# Altium project MailboxSensorV2.PrjPcb (part 2 of 4)
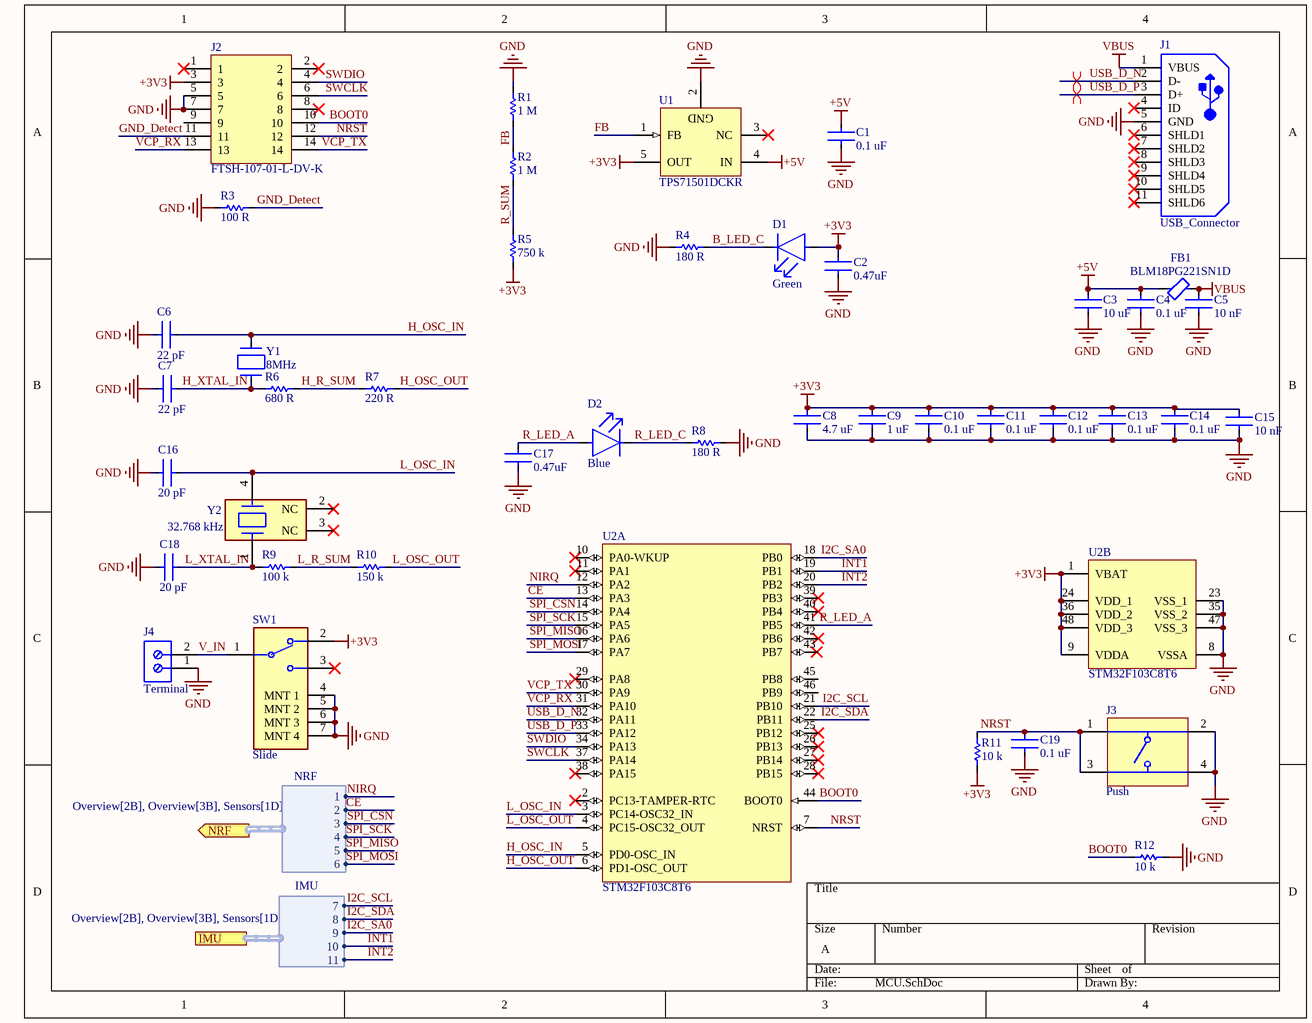
[diagram p3: MCU.SchDoc]

## Sheet MCU.SchDoc (continued)
### Library data of the parts
C1 C4 C10-C14 C19 = 0_1uF_0603_Capacitor: Ceramic Capacitor, Multilayer, Ceramic, 50V, 10% +Tol, 10% -Tol, X8L, -40/+15% TC, 0.1uF, Surface Mount, 0603, GCM188L81H104KA57D; Manufacturer: Murata; Value: 100nF; Multilayer: Yes; Reference Standard: AEC-Q200; Supplier: Digikey; Supplier Part Number: 490-6049-1-ND; Manufacturer Part Number: GCM188L81H104KA57D; RoHS: Yes; Category: Ceramic Capacitors; Stock: 1946064; Pricing: 1=0.13, 10=0.087, 50=0.0522, 100=0.0411, 500=0.03032, 1000=0.0251 (USD); Mounting Technology: Surface Mount; Pins: 2; Dielectric Material: Ceramic; Package Shape: Rectangular; Case/Package: 0603; Terminal Finish: Nickel; Min Operating Temperature: -55°C; Max Operating Temperature: 150°C; JESD-609 Code: e3; Capacitor Type: Ceramic; Tolerance  (fill in as +-): 10%; Packaging: Tape and Reel; Tolerance (fill in as +-): 10%; Rated DC Voltage (URdc): 50V; Temperature Characteristics Code: X8L; Termination: Wraparound; Reach SVHC Compliant: Yes; RoHS Compliant: Yes; ComponentLink1URL: https://datasheet.ciiva.com:443/pdfs/VipMasterIC/IC/MURE/MURE-S-A0004370842/MURE-S-A0004371512-1.pdf?src-supplier=IHS+Markit; ComponentLink1Description: https://datasheet.ciiva.com:443/pdfs/VipMasterIC/IC/MURE/MURE-S-A0004370842/MURE-S-A0004371512-1.pdf?src-supplier=IHS+Markit; Supplier 1: Digikey; Supplier Part Number 1: 490-6049-1-ND
C2 C17 = 0_47uF_0603_Capacitor: Ceramic Capacitor, Multilayer, Ceramic, 25V, 10% +Tol, 10% -Tol, X7R, 15% TC, 0.47uF, Surface Mount, 0603, GRM188R71E474KA12D; Manufacturer: Murata; Value: 470nF; Multilayer: Yes; Supplier: Digikey; Supplier Part Number: 490-3291-1-ND; Manufacturer Part Number: GRM188R71E474KA12D; RoHS: Yes; Category: Ceramic Capacitors; Stock: 1965293; Pricing: 1=0.16, 10=0.107, 50=0.0642, 100=0.0505, 500=0.03728, 1000=0.03087 (USD); Mounting Technology: Surface Mount; Pins: 2; Dielectric Material: Ceramic; Package Shape: Rectangular; Case/Package: 0603; Terminal Finish: Nickel; Min Operating Temperature: -55°C; Max Operating Temperature: 125°C; Capacitor Type: Ceramic; Tolerance  (fill in as +-): 10%; Package Style: SMTMeter; Packaging: Tape and Reel; Tolerance (fill in as +-): 10%; Rated DC Voltage (URdc): 25V; Temperature Characteristics Code: X7R; Termination: Wraparound; JESD-609 Code: e3; Length: 1.6mm; Width: 0.8mm; Height: 0.8mm; Reach SVHC Compliant: Yes; RoHS Compliant: Yes; ComponentLink1URL: https://datasheet.ciiva.com:443/pdfs/VipMasterIC/IC/MURE/MURE-S-A0004380799/MURE-S-A0004387457-1.pdf?src-supplier=IHS+Markit; ComponentLink1Description: https://datasheet.ciiva.com:443/pdfs/VipMasterIC/IC/MURE/MURE-S-A0004380799/MURE-S-A0004387457-1.pdf?src-supplier=IHS+Markit; Supplier 1: Digikey; Supplier Part Number 1: 490-3291-1-ND
C3 = 10uF_0603_Capacitor: Ceramic Capacitor, Multilayer, Ceramic, 6.3V, 10% +Tol, 10% -Tol, X5R, 15% TC, 10uF, Surface Mount, 0603, GRM188R60J106KE47D; Manufacturer: Murata; Multilayer: Yes; Supplier: Digikey; Supplier Part Number: 490-12538-1-ND; Manufacturer Part Number: GRM188R60J106KE47D; RoHS: Yes; Category: Ceramic Capacitors; Stock: 318904; Pricing: 1=0.13, 10=0.089, 50=0.053, 100=0.0417, 500=0.03078, 1000=0.02549 (USD); Mounting Technology: Surface Mount; Pins: 2; Dielectric Material: Ceramic; Package Shape: Rectangular; Case/Package: 0603; Terminal Finish: Nickel; Min Operating Temperature: -55°C; Max Operating Temperature: 85°C; JESD-609 Code: e3; Value: 10uF; Capacitor Type: Ceramic; Tolerance  (fill in as +-): 10%; Packaging: Tape and Reel; Tolerance (fill in as +-): 10%; Rated DC Voltage (URdc): 6.3V; Temperature Characteristics Code: X5R; Termination: Wraparound; Reach SVHC Compliant: Yes; RoHS Compliant: Yes; ComponentLink1URL: https://psearch.en.murata.com:443/capacitor/product/GRM188R60J106KE47%23.pdf?src-supplier=IHS+Markit; ComponentLink1Description: https://psearch.en.murata.com:443/capacitor/product/GRM188R60J106KE47%23.pdf?src-supplier=IHS+Markit; ComponentLink2URL: http://www.farnell.com/datasheets/1955679.pdf?src-supplier=Farnell; ComponentLink2Description: http://www.farnell.com/datasheets/1955679.pdf?src-supplier=Farnell; ComponentLink3URL: http://www.mouser.com/ds/2/281/c02e-2905.pdf?src-supplier=Mouser; ComponentLink3Description: http://www.mouser.com/ds/2/281/c02e-2905.pdf?src-supplier=Mouser; ComponentLink4URL: http://search.murata.co.jp/Ceramy/image/img/A01X/G101/ENG/GRM188R60J106KE47-02.pdf?src-supplier=Digikey; ComponentLink4Description: http://search.murata.co.jp/Ceramy/image/img/A01X/G101/ENG/GRM188R60J106KE47-02.pdf?src-supplier=Digikey; ComponentLink5URL: http://psearch.en.murata.com/capacitor/product/GRM188R60J106KE47%23.pdf?src-supplier=Avnet; ComponentLink5Description: http://psearch.en.murata.com/capacitor/product/GRM188R60J106KE47%23.pdf?src-supplier=Avnet; ComponentLink6URL: https://datasheet.octopart.com/GRM188R60J106KE47D-Murata-datasheet-76796297.pdf?src-supplier=Future+Electronics; ComponentLink6Description: https://datasheet.octopart.com/GRM188R60J106KE47D-Murata-datasheet-76796297.pdf?src-supplier=Future+Electronics; ComponentLink7URL: https://datasheet.octopart.com/GRM188R60J106KE47D-Murata-datasheet-46741883.pdf?src-supplier=Element14; ComponentLink7Description: https://datasheet.octopart.com/GRM188R60J106KE47D-Murata-datasheet-46741883.pdf?src-supplier=Element14; ComponentLink8URL: http://www.farnell.com/datasheets/1955679.pdf?src-supplier=Newark; ComponentLink8Description: http://www.farnell.com/datasheets/1955679.pdf?src-supplier=Newark; ComponentLink9URL: http://www.farnell.com/datasheets/1955679.pdf?src-supplier=Element14; ComponentLink9Description: http://www.farnell.com/datasheets/1955679.pdf?src-supplier=Element14; Supplier 1: Digikey; Supplier Part Number 1: 490-12538-1-ND
C5 C15 = 10nF_0603_Capacitor: Ceramic Capacitor, Multilayer, Ceramic, 50V, 10% +Tol, 10% -Tol, X7R, 15% TC, 0.01uF, Surface Mount, 0603, CC0603KRX7R9BB103; Manufacturer: Yageo; Value: 10nF; Multilayer: Yes; Supplier: Digikey; Supplier Part Number: 311-1085-1-ND; Manufacturer Part Number: CC0603KRX7R9BB103; RoHS: Yes; Category: Ceramic Capacitors; Stock: 4399663; Pricing: 1=0.1, 10=0.031, 50=0.0176, 100=0.0136, 500=0.01026, 1000=0.00805 (USD); Mounting Technology: Surface Mount; Pins: 2; Dielectric Material: Ceramic; Package Shape: Rectangular; Case/Package: 0603; Terminal Finish: Nickel; Min Operating Temperature: -55°C; Max Operating Temperature: 125°C; JESD-609 Code: e3; Capacitor Type: Ceramic; Tolerance  (fill in as +-): 10%; Package Style: SMTMeter; Packaging: Tape and Reel; Tolerance (fill in as +-): 10%; Rated DC Voltage (URdc): 50V; Temperature Characteristics Code: X7R; Termination: Wraparound; Length: 1.6mm; Width: 0.8mm; Height: 0.8mm; Reach SVHC Compliant: Yes; RoHS Compliant: Yes; ComponentLink1URL: https://datasheet.ciiva.com:443/pdfs/VipMasterIC/IC/YAGO/YAGO-S-A0003557223/YAGO-S-A0003557223-1.pdf?src-supplier=IHS+Markit; ComponentLink1Description: https://datasheet.ciiva.com:443/pdfs/VipMasterIC/IC/YAGO/YAGO-S-A0003557223/YAGO-S-A0003557223-1.pdf?src-supplier=IHS+Markit; Supplier 1: Digikey; Supplier Part Number 1: 311-1085-1-ND
C6 C7 = 22pF_0603_Capacitor: Ceramic Capacitor, Multilayer, Ceramic, 100V, 5% +Tol, 5% -Tol, C0G, 30ppm/Cel TC, 0.000022uF, Surface Mount, 0603, GCM1885C2A220JA16D; Manufacturer: Murata; Value: 22pF; Multilayer: Yes; Reference Standard: AEC-Q200; Supplier: Digikey; Supplier Part Number: 490-4942-1-ND; Manufacturer Part Number: GCM1885C2A220JA16D; RoHS: Yes; Category: Ceramic Capacitors; Stock: 113473; Pricing: 1=0.11, 10=0.074, 50=0.0424, 100=0.0329, 500=0.02476, 1000=0.01946 (USD); Mounting Technology: Surface Mount; Pins: 2; Dielectric Material: Ceramic; Package Shape: Rectangular; Case/Package: 0603; Terminal Finish: Nickel; Min Operating Temperature: -55°C; Max Operating Temperature: 125°C; JESD-609 Code: e3; Capacitor Type: Ceramic; Tolerance  (fill in as +-): 5%; Package Style: SMTMeter; Packaging: Tape and Reel; Tolerance (fill in as +-): 5%; Rated DC Voltage (URdc): 100V; Temperature Characteristics Code: C0G; Termination: Wraparound; Length: 1.6mm; Width: 0.8mm; Height: 0.9mm; Reach SVHC Compliant: Yes; RoHS Compliant: Yes; ComponentLink1URL: https://datasheet.ciiva.com:443/pdfs/VipMasterIC/IC/MURE/MURE-S-A0004365318/MURE-S-A0004370424-1.pdf?src-supplier=IHS+Markit; ComponentLink1Description: https://datasheet.ciiva.com:443/pdfs/VipMasterIC/IC/MURE/MURE-S-A0004365318/MURE-S-A0004370424-1.pdf?src-supplier=IHS+Markit; ComponentLink2URL: https://datasheet.ciiva.com/133/product-133318.pdf?src-supplier=Digikey; ComponentLink2Description: https://datasheet.ciiva.com/133/product-133318.pdf?src-supplier=Digikey; ComponentLink3URL: https://datasheet.ciiva.com/133/product-133319.pdf?src-supplier=Digikey; ComponentLink3Description: https://datasheet.ciiva.com/133/product-133319.pdf?src-supplier=Digikey; ComponentLink4URL: https://datasheet.ciiva.com/133/product-133320.pdf?src-supplier=Digikey; ComponentLink4Description: https://datasheet.ciiva.com/133/product-133320.pdf?src-supplier=Digikey; Supplier 1: Digikey; Supplier Part Number 1: 490-4942-1-ND
C8 = 4_7uF_0603_Capacitor: Ceramic Capacitor, Multilayer, Ceramic, 16V, 10% +Tol, 10% -Tol, X5R, 15% TC, 4.7uF, Surface Mount, 0603, GRM188R61C475KAAJD; Manufacturer: Murata; Multilayer: Yes; Supplier: Mouser; Supplier Part Number: 81-GRM188R61C475KAJD; Manufacturer Part Number: GRM188R61C475KAAJD; RoHS: Yes; Category: Ceramic Capacitors; Stock: 109257; Pricing: 1=0.28, 10=0.194, 50=0.194, 100=0.117, 1000=0.09, 10000=0.074 (USD); Mounting Technology: Surface Mount; Pins: 2; Dielectric Material: Ceramic; Package Shape: Rectangular; Case/Package: 0603; Terminal Finish: Nickel; Min Operating Temperature: -55°C; Max Operating Temperature: 85°C; JESD-609 Code: e3; Value: 4.7uF; Capacitor Type: Ceramic; Tolerance  (fill in as +-): 10%; Packaging: Tape and Reel; Tolerance (fill in as +-): 10%; Rated DC Voltage (URdc): 16V; Temperature Characteristics Code: X5R; Termination: Wraparound; Reach SVHC Compliant: Yes; RoHS Compliant: Yes; ComponentLink1URL: https://datasheet.ciiva.com:443/pdfs/VipMasterIC/IC/MURE/MURE-S-A0004349797/MURE-S-A0004352628-1.pdf?src-supplier=IHS+Markit; ComponentLink1Description: https://datasheet.ciiva.com:443/pdfs/VipMasterIC/IC/MURE/MURE-S-A0004349797/MURE-S-A0004352628-1.pdf?src-supplier=IHS+Markit; ComponentLink2URL: https://datasheet.ciiva.com/14813/595grm188r61c475kaaj23-14813668.pdf?src-supplier=Arrow+Electronics; ComponentLink2Description: https://datasheet.ciiva.com/14813/595grm188r61c475kaaj23-14813668.pdf?src-supplier=Arrow+Electronics; Supplier 1: Mouser; Supplier Part Number 1: 81-GRM188R61C475KAJD
C9 = 1uF_0603_Capacitor: Ceramic Capacitor, Multilayer, Ceramic, 50V, 10% +Tol, 10% -Tol, X5R, 15% TC, 1uF, Surface Mount, 0603, CC0603KRX5R9BB105; Manufacturer: Yageo; Multilayer: Yes; Supplier: Digikey; Supplier Part Number: 311-1787-1-ND; Manufacturer Part Number: CC0603KRX5R9BB105; RoHS: Yes; Category: Ceramic Capacitors; Stock: 90188; Pricing: 1=0.27, 10=0.178, 50=0.1124, 100=0.09, 500=0.065, 1000=0.05749 (USD); Mounting Technology: Surface Mount; Pins: 2; Dielectric Material: Ceramic; Package Shape: Rectangular; Case/Package: 0603; Terminal Finish: Nickel; Min Operating Temperature: -55°C; Max Operating Temperature: 85°C; JESD-609 Code: e3; Value: 1uF; Capacitor Type: Ceramic; Tolerance  (fill in as +-): 10%; Package Style: SMTMeter; Packaging: Tape and Reel; Tolerance (fill in as +-): 10%; Rated DC Voltage (URdc): 50V; Temperature Characteristics Code: X5R; Termination: Wraparound; Length: 1.6mm; Width: 0.8mm; Height: 0.8mm; Reach SVHC Compliant: Yes; RoHS Compliant: Yes; ComponentLink1URL: https://datasheet.ciiva.com:443/pdfs/VipMasterIC/IC/YAGO/YAGO-S-A0006851646/YAGO-S-A0006851646-1.pdf?src-supplier=IHS+Markit; ComponentLink1Description: https://datasheet.ciiva.com:443/pdfs/VipMasterIC/IC/YAGO/YAGO-S-A0006851646/YAGO-S-A0006851646-1.pdf?src-supplier=IHS+Markit; ComponentLink2URL: http://www.mouser.com/ds/2/447/Yageo_UPY-GP_NP0_16V-to-50V_9-358835.pdf?src-supplier=Mouser; ComponentLink2Description: http://www.mouser.com/ds/2/447/Yageo_UPY-GP_NP0_16V-to-50V_9-358835.pdf?src-supplier=Mouser; ComponentLink3URL: https://datasheet.octopart.com/CC0603KRX5R9BB105-Yageo-datasheet-170350636.pdf?src-supplier=Future+Electronics; ComponentLink3Description: https://datasheet.octopart.com/CC0603KRX5R9BB105-Yageo-datasheet-170350636.pdf?src-supplier=Future+Electronics; ComponentLink4URL: http://www.yageo.com/documents/recent/UPY-GPHC_X5R_4V-to-50V_25.pdf?src-supplier=Digikey; ComponentLink4Description: http://www.yageo.com/documents/recent/UPY-GPHC_X5R_4V-to-50V_25.pdf?src-supplier=Digikey; ComponentLink5URL: https://datasheet.octopart.com/CC0603KRX5R9BB105-Yageo-datasheet-140260304.pdf?src-supplier=Newark; ComponentLink5Description: https://datasheet.octopart.com/CC0603KRX5R9BB105-Yageo-datasheet-140260304.pdf?src-supplier=Newark; Supplier 1: Digikey; Supplier Part Number 1: 311-1787-1-ND
C16 C18 = 20pF_0603_Capacitor: Ceramic Capacitor, Multilayer, Ceramic, 50V, 5% +Tol, 5% -Tol, C0G, -/+30ppm/Cel TC, 0.00002uF, Surface Mount, 0603, CC0603JRNPO9BN200; Manufacturer: Yageo; Value: 20pF; Multilayer: Yes; Supplier: Digikey; Supplier Part Number: 311-1424-1-ND; Manufacturer Part Number: CC0603JRNPO9BN200; RoHS: Yes; Category: Ceramic Capacitors; Stock: 218320; Pricing: 1=0.1, 10=0.038, 50=0.0218, 100=0.017, 500=0.01276, 1000=0.01003 (USD); Mounting Technology: Surface Mount; Pins: 2; Dielectric Material: Ceramic; Case/Package: 0603; Terminal Finish: Nickel; Package Shape: Rectangular; Min Operating Temperature: -55°C; Max Operating Temperature: 125°C; JESD-609 Code: e3; Capacitor Type: Ceramic; Tolerance  (fill in as +-): 5%; Packaging: Tape and Reel; Tolerance (fill in as +-): 5%; Rated DC Voltage (URdc): 50V; Temperature Characteristics Code: C0G; Termination: Wraparound; Reach SVHC Compliant: Yes; RoHS Compliant: Yes; ComponentLink1URL: https://datasheet.ciiva.com:443/pdfs/VipMasterIC/IC/YAGO/YAGOS02763/YAGOS02763-1.pdf?src-supplier=IHS+Markit; ComponentLink1Description: https://datasheet.ciiva.com:443/pdfs/VipMasterIC/IC/YAGO/YAGOS02763/YAGOS02763-1.pdf?src-supplier=IHS+Markit; ComponentLink2URL: https://datasheet.ciiva.com/176/mlccorderingcode-176538.pdf?src-supplier=Digikey; ComponentLink2Description: https://datasheet.ciiva.com/176/mlccorderingcode-176538.pdf?src-supplier=Digikey; ComponentLink3URL: https://datasheet.ciiva.com/176/mlccorderingcode-176539.pdf?src-supplier=Digikey; ComponentLink3Description: https://datasheet.ciiva.com/176/mlccorderingcode-176539.pdf?src-supplier=Digikey; ComponentLink4URL: https://datasheet.ciiva.com/176/mlccorderingcode-176540.pdf?src-supplier=Digikey; ComponentLink4Description: https://datasheet.ciiva.com/176/mlccorderingcode-176540.pdf?src-supplier=Digikey; ComponentLink5URL: https://datasheet.ciiva.com/7978/1132289-7978134.pdf?src-supplier=Element14; ComponentLink5Description: https://datasheet.ciiva.com/7978/1132289-7978134.pdf?src-supplier=Element14; Supplier 1: Digikey; Supplier Part Number 1: 311-1424-1-ND
D1 = Green_LED: Single Color LED, Yellow Green, 1.1mm, VLMG1300-GS08; Manufacturer: Vishay Semiconductors; Color: Green,Yellow; Shape: Rectangular; Additional Feature: HIGH RELIABILITY; Forward Current: 30mA; Forward Voltage: 2.4V; Luminous Intensity-Nom: 35mcd; Channels: 1; Optoelectronic Device Type: DUAL COLOR LED; Reverse Voltage-Max: 5V; Viewing Angle: 130°; Overall Height: 0.8mm; Supplier: Digikey; Supplier Part Number: VLMG1300-GS08CT-ND; Manufacturer Part Number: VLMG1300-GS08; RoHS: Yes; Category: LEDs; Stock: 12007; Pricing: 1=0.3, 10=0.237, 100=0.1065, 500=0.09616, 1000=0.07898 (USD); Mounting Technology: Surface Mount; Pins: 2; Color@wavelength: Green; Min Operating Temperature: -35°C; Max Operating Temperature: 85°C; Packaging: Tape and Reel; Size: 1.1mm; Terminal Pitch: 1.5mm; Reach SVHC Compliant: Yes; RoHS Compliant: Yes; ComponentLink1URL: https://datasheet.ciiva.com:443/pdfs/VipMasterIC/IC/VISH/VISH-S-A0004564149/VISH-S-A0004564149-1.pdf?src-supplier=IHS+Markit; ComponentLink1Description: https://datasheet.ciiva.com:443/pdfs/VipMasterIC/IC/VISH/VISH-S-A0004564149/VISH-S-A0004564149-1.pdf?src-supplier=IHS+Markit; ComponentLink2URL: https://datasheet.ciiva.com/8028/vlmo1300-8028023.pdf?src-supplier=Element14; ComponentLink2Description: https://datasheet.ciiva.com/8028/vlmo1300-8028023.pdf?src-supplier=Element14; ComponentLink3URL: https://datasheet.ciiva.com/2114/vlmo1300-2114971.pdf?src-supplier=Digikey; ComponentLink3Description: https://datasheet.ciiva.com/2114/vlmo1300-2114971.pdf?src-supplier=Digikey; ComponentLink4URL: https://datasheet.ciiva.com/2114/vlmo1300-2114972.pdf?src-supplier=Digikey; ComponentLink4Description: https://datasheet.ciiva.com/2114/vlmo1300-2114972.pdf?src-supplier=Digikey; ComponentLink5URL: https://datasheet.ciiva.com/2114/vlmo1300-2114973.pdf?src-supplier=Digikey; ComponentLink5Description: https://datasheet.ciiva.com/2114/vlmo1300-2114973.pdf?src-supplier=Digikey; ComponentLink6URL: https://datasheet.ciiva.com/9333/vlmo1300-9333390.pdf?src-supplier=Avnet; ComponentLink6Description: https://datasheet.ciiva.com/9333/vlmo1300-9333390.pdf?src-supplier=Avnet; ComponentLink7URL: https://datasheet.ciiva.com/26322/vlmo1300-26322139.pdf?src-supplier=Element14; ComponentLink7Description: https://datasheet.ciiva.com/26322/vlmo1300-26322139.pdf?src-supplier=Element14; ComponentLink8URL: https://datasheet.ciiva.com/26322/vlmo1300-26322140.pdf?src-supplier=Element14; ComponentLink8Description: https://datasheet.ciiva.com/26322/vlmo1300-26322140.pdf?src-supplier=Element14; Supplier 1: Digikey; Supplier Part Number 1: VLMG1300-GS08CT-ND
D2 = Blue_LED: Single Color LED, Ultra Bright Blue, Water Clear, 1.1mm, LTST-C191TBKT; Manufacturer: Vishay Lite-On; Shape: Rectangular; Forward Current: 20mA; Luminous Intensity-Nom: 104mcd; Channels: 1; Viewing Angle: 130°; Forward Voltage: 3.8V; Reverse Voltage-Max: 5V; Luminous Intensity-Min: 130cd; Overall Height: 0.55mm; Supplier: Digikey; Supplier Part Number: 160-1647-1-ND; Manufacturer Part Number: LTST-C191TBKT; RoHS: Yes; Category: LEDs; Stock: 182377; Pricing: 1=0.34, 10=0.265, 100=0.119, 500=0.10746, 1000=0.08827, 2000=0.07676 (USD); Mounting Technology: Surface Mount; Pins: 2; Color: Blue; Color@wavelength: Blue; Terminal Finish: Tin; Min Operating Temperature: -20°C; Max Operating Temperature: 80°C; Optoelectronic Device Type: SINGLE COLOR LED; Packaging: Tape and Reel; JESD-609 Code: e3; Lens Style: WATER CLEAR; Size: 1.1mm; Terminal Pitch: 1.5mm; Reach SVHC Compliant: Yes; RoHS Compliant: Yes; ComponentLink1URL: https://datasheet.ciiva.com:443/pdfs/VipMasterIC/IC/LITE/LITE-S-A0009182577/LITE-S-A0009182577-1.pdf?src-supplier=IHS+Markit; ComponentLink1Description: https://datasheet.ciiva.com:443/pdfs/VipMasterIC/IC/LITE/LITE-S-A0009182577/LITE-S-A0009182577-1.pdf?src-supplier=IHS+Markit; Supplier 1: Digikey; Supplier Part Number 1: 160-1647-1-ND
FB1 = Ferrite_Bead: Ferrite Chip, 1 Function(s), 1.4A, 2 Pin(s), BLM18PG221SN1D; Manufacturer: Murata; DC Resistance-Max: 100mR; Clock Frequency: 100MHz; Channels: 1; Output Impedance: 220R; Supplier: Digikey; Supplier Part Number: 490-5221-1-ND; Manufacturer Part Number: BLM18PG221SN1D; RoHS: Yes; Category: Ferrite Beads and Chips; Stock: 159892; Pricing: 1=0.1, 10=0.078, 25=0.0712, 50=0.064, 100=0.0469, 250=0.03412, 500=0.03128, 1000=0.02701 (USD); Mounting Technology: Surface Mount; Material: Ferrite; Case Code: 0603; Terminal Finish: Tin; Min Operating Temperature: -55°C; Max Operating Temperature: 125°C; JESD-609 Code: e3; Construction: Chip Bead; Filter Type: FERRITE CHIP; Min Frequency: 100MHz; Packaging: Tape and Reel; Current Rating: 1.4A; Length: 1.6mm; Width: 0.8mm; Height: 0.8mm; Reach SVHC Compliant: Yes; RoHS Compliant: Yes; ComponentLink1URL: https://datasheet.ciiva.com:443/pdfs/VipMasterIC/IC/MURE/MURE-S-A0008515861/MURE-S-A0008515861-1.pdf?src-supplier=IHS+Markit; ComponentLink1Description: https://datasheet.ciiva.com:443/pdfs/VipMasterIC/IC/MURE/MURE-S-A0008515861/MURE-S-A0008515861-1.pdf?src-supplier=IHS+Markit; ComponentLink2URL: https://datasheet.ciiva.com/19458/1845030-19458417.pdf?src-supplier=Jameco; ComponentLink2Description: https://datasheet.ciiva.com/19458/1845030-19458417.pdf?src-supplier=Jameco; ComponentLink3URL: https://datasheet.ciiva.com/11800/0900766b81275ca5-11800851.pdf?src-supplier=Rs; ComponentLink3Description: https://datasheet.ciiva.com/11800/0900766b81275ca5-11800851.pdf?src-supplier=Rs; ComponentLink4URL: https://datasheet.ciiva.com/29347/442391-da-01-en-chip-drossel-0603-220r-1400ma-1-6x0-8mm-29347986.pdf?src-supplier=Conrad; ComponentLink4Description: https://datasheet.ciiva.com/29347/442391-da-01-en-chip-drossel-0603-220r-1400ma-1-6x0-8mm-29347986.pdf?src-supplier=Conrad; ComponentLink5URL: https://datasheet.ciiva.com/1012/l0110s0100blm18p-1012161.pdf?src-supplier=Digikey; ComponentLink5Description: https://datasheet.ciiva.com/1012/l0110s0100blm18p-1012161.pdf?src-supplier=Digikey; ComponentLink6URL: https://datasheet.ciiva.com/1012/l0110s0100blm18p-1012162.pdf?src-supplier=Digikey; ComponentLink6Description: https://datasheet.ciiva.com/1012/l0110s0100blm18p-1012162.pdf?src-supplier=Digikey; ComponentLink7URL: https://datasheet.ciiva.com/1012/l0110s0100blm18p-1012163.pdf?src-supplier=Digikey; ComponentLink7Description: https://datasheet.ciiva.com/1012/l0110s0100blm18p-1012163.pdf?src-supplier=Digikey; ComponentLink8URL: https://datasheet.ciiva.com/3081/l0110s0100blm18p-3081633.pdf?src-supplier=Avnet; ComponentLink8Description: https://datasheet.ciiva.com/3081/l0110s0100blm18p-3081633.pdf?src-supplier=Avnet; ComponentLink9URL: https://datasheet.ciiva.com/8021/5148-8021482.pdf?src-supplier=Element14; ComponentLink9Description: https://datasheet.ciiva.com/8021/5148-8021482.pdf?src-supplier=Element14; ComponentLink10URL: https://datasheet.ciiva.com/8021/5148-8021479.pdf?src-supplier=Element14; ComponentLink10Description: https://datasheet.ciiva.com/8021/5148-8021479.pdf?src-supplier=Element14; ComponentLink11URL: https://datasheet.ciiva.com/14122/blm-series-eng-tds-14122909.pdf?src-supplier=Distrelec; ComponentLink11Description: https://datasheet.ciiva.com/14122/blm-series-eng-tds-14122909.pdf?src-supplier=Distrelec; ComponentLink12URL: https://datasheet.ciiva.com/16205/l0110s0100blm18p-16205422.pdf?src-supplier=Future+Electronics; ComponentLink12Description: https://datasheet.ciiva.com/16205/l0110s0100blm18p-16205422.pdf?src-supplier=Future+Electronics; Supplier 1: Digikey; Supplier Part Number 1: 490-5221-1-ND
J1 = USB_Connector: Telecom and Datacom Connector, 5 Contact(s), Female, Right Angle, Surface Mount Terminal, Detent, Receptacle, 1050170001; Manufacturer: Molex; Number of Contacts: 5; Option: General Purpose; Additional Feature: Shielded; Board Mounting Option: PEG; Contact Resistance: 30mR; Contact Style: USB; Dielectric Withstanding Voltage (AC): 100V; Durability: 10000Cycles; Empty Shell: No; Insulation Resistance: 1GR; Number Of Connectors: 1; PCB Contact Pattern: RECTANGULAR; Polarization Key: POLARIZED HOUSING; Rated Current (Signal): 1.8A; Body Breadth: 0.114inch; Body Depth: 0.213inch; Body Length: 0.315inch; Mounting Option 2: LOCKING; Reference Standard: UL; Reliability: COMMERCIAL; Supplier: Mouser; Supplier Part Number: 538-105017-0001; Manufacturer Part Number: 1050170001; RoHS: Yes; Category: USB Connectors; Stock: 33502; Pricing: 1=1.01, 10=0.856, 50=0.856, 100=0.769, 500=0.629, 1000=0.559, 2000=0.507, 4000=0.495, 10000=0.495 (USD); Mounting Technology: Cable; Contact Finish - Mating: GOLD; Shell Material: Stainless Steel; Contact Material: Copper Alloy; Contact Finish - Termination: Gold (Au) - with Nickel (Ni) barrier; Insulation Material: Polymer; Shell Finish: Tin; Min Operating Temperature: -30°C; Max Operating Temperature: 85°C; Connector Type: TELECOM AND DATACOM CONNECTOR; Body/Shell Style: RECEPTACLE; Contact Gender: Female; Mounting Style: RIGHT ANGLE; Termination: SMD/SMT; JESD-609 Code: e4; Filter Feature: No; Mixed Contacts: No; Number Of PCB Rows: 1; Mounting Option 1: DETENT; Terminal Pitch: 0.635mm; Reach SVHC Compliant: Yes; RoHS Compliant: Yes; DIN Conformance: No; IEC Conformance: No; MIL Conformance: No; ComponentLink1URL: https://datasheet.ciiva.com:443/pdfs/VipMasterIC/IC/MOLE/MOLE-S-A0006795785/MOLE-S-A0006864883-1.pdf?src-supplier=IHS+Markit; ComponentLink1Description: https://datasheet.ciiva.com:443/pdfs/VipMasterIC/IC/MOLE/MOLE-S-A0006795785/MOLE-S-A0006864883-1.pdf?src-supplier=IHS+Markit; Supplier 1: Digikey; Supplier Part Number 1: WM1399CT-ND
J2 = SWD_Header_Connector: Board Connector, 14 Contact(s), 2 Row(s), Male, Straight, 0.05 inch Pitch, Surface Mount Terminal, Locking, Receptacle, FTSH-107-01-L-DV-K; Manufacturer: Samtec; Option: General Purpose; Contact Pattern: RECTANGULAR; Contact Style: SQ PIN-SKT; Filter Feature: No; Number Of Connectors: 1; Number Of PCB Rows: 2; Number of Contacts: 14; Mating Information: MULTIPLE MATING PARTS AVAILABLE; Body Breadth: 0.135inch; Body Length: 0.35inch; PCB Contact Row Spacing: 4.064mm; Plating Thickness: 10uin; Reference Standard: UL; Reliability: COMMERCIAL; Supplier: Digikey; Supplier Part Number: SAM9449-ND; Manufacturer Part Number: FTSH-107-01-L-DV-K; RoHS: Yes; Category: Headers and Wire Housings; Stock: 4794; Pricing: 1=3.08, 10=2.797, 100=2.4644, 500=2.09474, 1000=1.78669, 5000=1.60186 (USD); Mounting Technology: Board; Contact Finish - Termination: Tin (Sn) - with Nickel (Ni) barrier; Contact Material: Bronze; Contact Finish - Mating: GOLD (10) OVER NICKEL (50); Insulation Material: Polymer; Connector Type: BOARD CONNECTOR; JESD-609 Code: e3; Contact Gender: Male; Mixed Contacts: No; Mounting Style: STRAIGHT; Number of Rows Loaded: 2; PCB Contact Pattern: RECTANGULAR; Termination: SMD/SMT; Body/Shell Style: RECEPTACLE; Mating Contact Pitch: 0.05inch; Mating Contact Row Spacing: 0.05inch; Mounting Option 1: LOCKING; Terminal Pitch: 1.27mm; Flammability Rating: UL94 V-0; Reach SVHC Compliant: Yes; RoHS Compliant: Yes; DIN Conformance: No; IEC Conformance: No; MIL Conformance: No; ComponentLink1URL: https://datasheet.ciiva.com:443/pdfs/VipMasterIC/IC/SAMI/SAMI-S-A0002896813/SAMI-S-A0002896813-1.pdf?src-supplier=IHS+Markit; ComponentLink1Description: https://datasheet.ciiva.com:443/pdfs/VipMasterIC/IC/SAMI/SAMI-S-A0002896813/SAMI-S-A0002896813-1.pdf?src-supplier=IHS+Markit; ComponentLink2URL: https://datasheet.ciiva.com/10025/ftsh-mt-10025350.pdf?src-supplier=Avnet; ComponentLink2Description: https://datasheet.ciiva.com/10025/ftsh-mt-10025350.pdf?src-supplier=Avnet; Supplier 1: Digikey; Supplier Part Number 1: SAM9449-ND
J3 = Push_Button: Keypad Switch, 1 Switches, SPST, Momentary-tactile, 0.05A, 24VDC, 2.06N, 4 PCB Hole Cnt, Solder Terminal, Through Hole-straight, 1825910-6 TE Connectivity Alcoswitch; Electrical Life: 100000Cycles; Contact Current(DC)-Max: 50mA; Contact DC Max Rating R Load: .05A@24VDC; Contact Voltage(DC)-Max: 24V; Circuit Configuration: 1X1; Number of Switches: 1; Body Breadth: 5.99inch; Body Length or Diameter: 5.99mm; Body Height: 3.61mm; Supplier: Digikey; Supplier Part Number: 450-1650-ND; Manufacturer: TE Connectivity Alcoswitch; Manufacturer Part Number: 1825910-6; RoHS: Yes; Category: Pushbutton Switches; Stock: 45133; Pricing: 1=0.13, 10=0.125, 25=0.1184, 100=0.1078, 250=0.10132, 750=0.09268, 1500=0.07759, 3000=0.07544, 5250=0.07113 (USD); Mounting Technology: Through Hole; Min Operating Temperature: -35°C; Max Operating Temperature: 85°C; Switch Action: MOMENTARY; Switch Function: SPST; Switch Type: Keypad; Termination: Solder; Operating Force-Max: 2.06N; Reach SVHC Compliant: Yes; RoHS Compliant: Yes; ComponentLink1URL: https://datasheet.ciiva.com:443/pdfs/VipMasterIC/IC/TYEL/TYEL-S-A0008869674/TYEL-S-A0008850909-1.pdf?src-supplier=IHS+Markit; ComponentLink1Description: https://datasheet.ciiva.com:443/pdfs/VipMasterIC/IC/TYEL/TYEL-S-A0008869674/TYEL-S-A0008850909-1.pdf?src-supplier=IHS+Markit; Supplier 1: Digikey; Supplier Part Number 1: 450-1650-ND
J4 = Screw_Terminal: Barrier Strip Terminal Block, 6A, 0.5mm2, 1 Row(s), 1 Deck(s), 1725656 Phoenix Contact; Fastening Method: SCREW; Number of Decks: 1; Number of Ways: 2; Voltage Rating: 160V; Wire/Cable Gauge: 20AWG; Safety Approval: UL,CSA,CUL,EAC; Supplier: Digikey; Supplier Part Number: 277-1273-ND; Manufacturer: Phoenix Contact; Manufacturer Part Number: 1725656; RoHS: Yes; Category: Terminal Blocks; Stock: 10011; Pricing: 1=1.19 (USD); Mounting Technology: Board; Terminal and Terminal Block Type: BARRIER STRIP TERMINAL BLOCK; Number of Rows: 1; Current Rating: 6A; Wire Cross Section: 0.5mm2; RoHS Compliant: Yes; Reach SVHC Compliant: No; ComponentLink1URL: https://www.phoenixcontact.com:443/online/portal/us?uri=pxc-oc-itemdetail%3apid%3d1725656&library=usen&pcck=P-11-01-05&tab=1&src-supplier=IHS+Markit; ComponentLink1Description: https://www.phoenixcontact.com:443/online/portal/us?uri=pxc-oc-itemdetail%3apid%3d1725656&library=usen&pcck=P-11-01-05&tab=1&src-supplier=IHS+Markit; ComponentLink2URL: https://datasheet.ciiva.com/1120/319957-1120510.pdf?src-supplier=Farnell; ComponentLink2Description: https://datasheet.ciiva.com/1120/319957-1120510.pdf?src-supplier=Farnell; ComponentLink3URL: https://datasheet.ciiva.com/823/1725656-823793.pdf?src-supplier=Digikey; ComponentLink3Description: https://datasheet.ciiva.com/823/1725656-823793.pdf?src-supplier=Digikey; ComponentLink4URL: https://datasheet.ciiva.com/16071/1725656-16071846.pdf?src-supplier=Onlinecomponents.com; ComponentLink4Description: https://datasheet.ciiva.com/16071/1725656-16071846.pdf?src-supplier=Onlinecomponents.com; ComponentLink5URL: https://datasheet.ciiva.com/15169/getdatasheetpartid-199323-15169849.pdf?src-supplier=Verical; ComponentLink5Description: https://datasheet.ciiva.com/15169/getdatasheetpartid-199323-15169849.pdf?src-supplier=Verical; ComponentLink6URL: https://datasheet.ciiva.com/26340/788052-da-01-en-100ntklemme-1725656-250-st-26340907.pdf?src-supplier=Conrad; ComponentLink6Description: https://datasheet.ciiva.com/26340/788052-da-01-en-100ntklemme-1725656-250-st-26340907.pdf?src-supplier=Conrad; Supplier 1: Digikey; Supplier Part Number 1: 277-1273-ND
R1 R2 = 1M_0603_Resistor: Fixed Resistor, Metal Glaze/thick Film, 0.1W, 1000000ohm, 75V, 1% +/-Tol, 100ppm/Cel, Surface Mount, 0603, CRCW06031M00FKEA; Manufacturer: Vishay; Power: 100mW; Value: 1MR; Temperature Coefficient: 100ppm/°C; Rated Temperature: 70°C; Package Height: 0.45mm; Package Length: 1.55mm; Package Width: 0.85mm; Reference Standard: AEC-Q200; Supplier: Digikey; Supplier Part Number: 541-1.00MHCT-ND; Manufacturer Part Number: CRCW06031M00FKEA; RoHS: Yes; Category: Chip SMD Resistors; Stock: 583183; Pricing: 1=0.1, 10=0.026, 50=0.0166, 100=0.014, 500=0.00954, 1000=0.00824 (USD); Mounting Technology: Surface Mount; Pins: 2; Case/Package: 0603; Package Shape: Rectangular; Terminal Finish: Nickel; Min Operating Temperature: -55°C; Max Operating Temperature: 155°C; Tolerance: 1%; Resistor Type: FIXED RESISTOR; Construction: Chip; Package Style: SMTMeter; Packaging: Tape and Reel; Working Voltage: 75V; JESD-609 Code: e3; Termination: Wraparound; Technology: METAL GLAZE/THICK FILM; Reach SVHC Compliant: Yes; RoHS Compliant: Yes; ComponentLink1URL: https://datasheet.ciiva.com:443/pdfs/VipMasterIC/IC/VISH/VISH-S-A0007266705/VISH-S-A0007266705-1.pdf?src-supplier=IHS+Markit; ComponentLink1Description: https://datasheet.ciiva.com:443/pdfs/VipMasterIC/IC/VISH/VISH-S-A0007266705/VISH-S-A0007266705-1.pdf?src-supplier=IHS+Markit; ComponentLink2URL: https://datasheet.ciiva.com/11809/0900766b80d98afc-11809074.pdf?src-supplier=Rs; ComponentLink2Description: https://datasheet.ciiva.com/11809/0900766b80d98afc-11809074.pdf?src-supplier=Rs; ComponentLink3URL: https://datasheet.ciiva.com/2465/dcrcwe3-2465549.pdf?src-supplier=Digikey; ComponentLink3Description: https://datasheet.ciiva.com/2465/dcrcwe3-2465549.pdf?src-supplier=Digikey; ComponentLink4URL: https://datasheet.ciiva.com/2465/dcrcwe3-2465550.pdf?src-supplier=Digikey; ComponentLink4Description: https://datasheet.ciiva.com/2465/dcrcwe3-2465550.pdf?src-supplier=Digikey; ComponentLink5URL: https://datasheet.ciiva.com/2465/dcrcwe3-2465551.pdf?src-supplier=Digikey; ComponentLink5Description: https://datasheet.ciiva.com/2465/dcrcwe3-2465551.pdf?src-supplier=Digikey; ComponentLink6URL: https://datasheet.ciiva.com/7841/1720486-7841822.pdf?src-supplier=Element14; ComponentLink6Description: https://datasheet.ciiva.com/7841/1720486-7841822.pdf?src-supplier=Element14; ComponentLink7URL: https://datasheet.ciiva.com/7841/125364-7841823.pdf?src-supplier=Element14; ComponentLink7Description: https://datasheet.ciiva.com/7841/125364-7841823.pdf?src-supplier=Element14; ComponentLink8URL: https://datasheet.ciiva.com/26314/fld-crcw-e3-data-en-26314645.pdf?src-supplier=Distrelec; ComponentLink8Description: https://datasheet.ciiva.com/26314/fld-crcw-e3-data-en-26314645.pdf?src-supplier=Distrelec; ComponentLink9URL: https://datasheet.ciiva.com/16311/dcrcwe3-16311533.pdf?src-supplier=Future+Electronics; ComponentLink9Description: https://datasheet.ciiva.com/16311/dcrcwe3-16311533.pdf?src-supplier=Future+Electronics; Supplier 1: Digikey; Supplier Part Number 1: 541-1.00MHCT-ND
R3 = 100R_0603_Resistor: Fixed Resistor, Metal Glaze/thick Film, 0.1W, 100ohm, 75V, 1% +/-Tol, 100ppm/Cel, Surface Mount, 0603, CRCW0603100RFKEA; Manufacturer: Vishay Dale; Power: 100mW; Rated Temperature: 70°C; Value: 100R; Temperature Coefficient: 100ppm/°C; Package Height: 0.45mm; Package Length: 1.55mm; Package Width: 0.85mm; Reference Standard: AEC-Q200; Supplier: Digikey; Supplier Part Number: 541-100HCT-ND; Manufacturer Part Number: CRCW0603100RFKEA; RoHS: Yes; Category: Chip SMD Resistors; Stock: 468740; Pricing: 1=0.1, 10=0.026, 50=0.0166, 100=0.014, 500=0.00954, 1000=0.00824 (USD); Mounting Technology: Surface Mount; Pins: 2; Case/Package: 0603; Terminal Finish: Nickel; Package Shape: Rectangular; Min Operating Temperature: -55°C; Max Operating Temperature: 155°C; Tolerance: 1%; Resistor Type: FIXED RESISTOR; Packaging: Tape and Reel; Technology: METAL GLAZE/THICK FILM; Termination: Wraparound; Working Voltage: 75V; JESD-609 Code: e3; Construction: Chip; Package Style: SMTMeter; Reach SVHC Compliant: Yes; RoHS Compliant: Yes; ComponentLink1URL: https://datasheet.ciiva.com:443/pdfs/VipMasterIC/IC/VISH/VISH-S-A0007266705/VISH-S-A0007266705-1.pdf?src-supplier=IHS+Markit; ComponentLink1Description: https://datasheet.ciiva.com:443/pdfs/VipMasterIC/IC/VISH/VISH-S-A0007266705/VISH-S-A0007266705-1.pdf?src-supplier=IHS+Markit; ComponentLink2URL: https://datasheet.ciiva.com/2465/dcrcwe3-2465543.pdf?src-supplier=Digikey; ComponentLink2Description: https://datasheet.ciiva.com/2465/dcrcwe3-2465543.pdf?src-supplier=Digikey; ComponentLink3URL: https://datasheet.ciiva.com/2465/dcrcwe3-2465544.pdf?src-supplier=Digikey; ComponentLink3Description: https://datasheet.ciiva.com/2465/dcrcwe3-2465544.pdf?src-supplier=Digikey; ComponentLink4URL: https://datasheet.ciiva.com/2465/dcrcwe3-2465545.pdf?src-supplier=Digikey; ComponentLink4Description: https://datasheet.ciiva.com/2465/dcrcwe3-2465545.pdf?src-supplier=Digikey; ComponentLink5URL: https://datasheet.ciiva.com/26316/fld-crcw-e3-data-en-26316566.pdf?src-supplier=Distrelec; ComponentLink5Description: https://datasheet.ciiva.com/26316/fld-crcw-e3-data-en-26316566.pdf?src-supplier=Distrelec; ComponentLink6URL: https://datasheet.ciiva.com/5550/dcrcwe3-109170-5550286.pdf?src-supplier=Mouser; ComponentLink6Description: https://datasheet.ciiva.com/5550/dcrcwe3-109170-5550286.pdf?src-supplier=Mouser; ComponentLink7URL: https://datasheet.ciiva.com/16721/70201119-16721486.pdf?src-supplier=Allied+Electronics; ComponentLink7Description: https://datasheet.ciiva.com/16721/70201119-16721486.pdf?src-supplier=Allied+Electronics; ComponentLink8URL: https://datasheet.ciiva.com/16787/70201119-16787964.pdf?src-supplier=Allied+Electronics; ComponentLink8Description: https://datasheet.ciiva.com/16787/70201119-16787964.pdf?src-supplier=Allied+Electronics; ComponentLink9URL: https://datasheet.ciiva.com/22666/1720486-22666207.pdf?src-supplier=Element14; ComponentLink9Description: https://datasheet.ciiva.com/22666/1720486-22666207.pdf?src-supplier=Element14; ComponentLink10URL: https://datasheet.ciiva.com/22673/1697337-22673066.pdf?src-supplier=Element14; ComponentLink10Description: https://datasheet.ciiva.com/22673/1697337-22673066.pdf?src-supplier=Element14; ComponentLink11URL: https://datasheet.ciiva.com/16199/dcrcwe3-16199102.pdf?src-supplier=Future+Electronics; ComponentLink11Description: https://datasheet.ciiva.com/16199/dcrcwe3-16199102.pdf?src-supplier=Future+Electronics; Supplier 1: Digikey; Supplier Part Number 1: 541-100HCT-ND
R4 R8 = 180R_0603_Resistor: Fixed Resistor, Metal Glaze/thick Film, 0.1W, 180ohm, 75V, 1% +/-Tol, 100ppm/Cel, Surface Mount, 0603, ERJ-3EKF1800V; Manufacturer: Panasonic; Power: 100mW; Rated Temperature: 70°C; Value: 180R; Temperature Coefficient: 100ppm/°C; Package Height: 0.45mm; Package Length: 1.6mm; Package Width: 0.8mm; Reference Standard: AEC-Q200; Supplier: Digikey; Supplier Part Number: P180HCT-ND; Manufacturer Part Number: ERJ-3EKF1800V; RoHS: Yes; Category: Chip SMD Resistors; Stock: 114631; Pricing: 1=0.1, 10=0.03, 50=0.0194, 100=0.0163, 500=0.01132, 1000=0.0098 (USD); Mounting Technology: Surface Mount; Pins: 2; Package Shape: Rectangular; Case/Package: 0603; Terminal Finish: Nickel; Min Operating Temperature: -55°C; Max Operating Temperature: 155°C; Tolerance: 1%; JESD-609 Code: e3; Resistor Type: FIXED RESISTOR; Construction: Rectangular; Package Style: SMTMeter; Packaging: Tape and Reel; Technology: METAL GLAZE/THICK FILM; Termination: Wraparound; Working Voltage: 75V; Reach SVHC Compliant: Yes; RoHS Compliant: Yes; ComponentLink1URL: https://datasheet.ciiva.com:443/pdfs/VipMasterIC/IC/PANA/PANA-S-A0009889626/PANA-S-A0009889626-1.pdf?src-supplier=IHS+Markit; ComponentLink1Description: https://datasheet.ciiva.com:443/pdfs/VipMasterIC/IC/PANA/PANA-S-A0009889626/PANA-S-A0009889626-1.pdf?src-supplier=IHS+Markit; ComponentLink2URL: https://datasheet.ciiva.com/46444/1678782-46444812.pdf?src-supplier=Element14; ComponentLink2Description: https://datasheet.ciiva.com/46444/1678782-46444812.pdf?src-supplier=Element14; ComponentLink3URL: https://datasheet.ciiva.com/7909/aoa0000ce2-7909194.pdf?src-supplier=Element14; ComponentLink3Description: https://datasheet.ciiva.com/7909/aoa0000ce2-7909194.pdf?src-supplier=Element14; ComponentLink4URL: https://datasheet.ciiva.com/7909/426256-7909547.pdf?src-supplier=Element14; ComponentLink4Description: https://datasheet.ciiva.com/7909/426256-7909547.pdf?src-supplier=Element14; ComponentLink5URL: https://datasheet.ciiva.com/9184/aoa0000ce2-9184887.pdf?src-supplier=Avnet; ComponentLink5Description: https://datasheet.ciiva.com/9184/aoa0000ce2-9184887.pdf?src-supplier=Avnet; ComponentLink6URL: https://datasheet.ciiva.com/24159/aoa0000ce2-24159085.pdf?src-supplier=Mouser; ComponentLink6Description: https://datasheet.ciiva.com/24159/aoa0000ce2-24159085.pdf?src-supplier=Mouser; ComponentLink7URL: https://datasheet.ciiva.com/30264/aoa0000ce2-30264058.pdf?src-supplier=Onlinecomponents.com; ComponentLink7Description: https://datasheet.ciiva.com/30264/aoa0000ce2-30264058.pdf?src-supplier=Onlinecomponents.com; Supplier 1: Digikey; Supplier Part Number 1: P180HCT-ND
R5 = 750k_0603_Resistor: Fixed Resistor, Metal Glaze/thick Film, 0.1W, 750000ohm, 75V, 1% +/-Tol, 100ppm/Cel, Surface Mount, 0603, RC0603FR-07750KL; Manufacturer: Yageo; Power: 100mW; Value: 750kR; Temperature Coefficient: 100ppm/°C; Rated Temperature: 70°C; Additional Feature: LASER TRIMMABLE; Package Height: 0.45mm; Package Length: 1.6mm; Package Width: 0.8mm; Supplier: Digikey; Supplier Part Number: 311-750KHRCT-ND; Manufacturer Part Number: RC0603FR-07750KL; RoHS: Yes; Category: Chip SMD Resistors; Stock: 269456; Pricing: 1=0.1, 10=0.019, 50=0.0112, 100=0.0093, 500=0.00622, 1000=0.00532 (USD); Mounting Technology: Surface Mount; Pins: 2; Package Shape: Rectangular; Case/Package: 0603; Terminal Finish: Nickel; Min Operating Temperature: -55°C; Max Operating Temperature: 155°C; Tolerance: 1%; Resistor Type: FIXED RESISTOR; Construction: Chip; Package Style: SMTMeter; Packaging: Tape and Reel; Technology: METAL GLAZE/THICK FILM; Working Voltage: 75V; JESD-609 Code: e3; Termination: Wraparound; Reach SVHC Compliant: Yes; RoHS Compliant: Yes; ComponentLink1URL: https://datasheet.ciiva.com:443/pdfs/VipMasterIC/IC/YAGO/YAGO-S-A0008145938/YAGO-S-A0008145938-1.pdf?src-supplier=IHS+Markit; ComponentLink1Description: https://datasheet.ciiva.com:443/pdfs/VipMasterIC/IC/YAGO/YAGO-S-A0008145938/YAGO-S-A0008145938-1.pdf?src-supplier=IHS+Markit; ComponentLink2URL: https://datasheet.ciiva.com/15189/getdatasheetpartid-326522-15189814.pdf?src-supplier=Verical; ComponentLink2Description: https://datasheet.ciiva.com/15189/getdatasheetpartid-326522-15189814.pdf?src-supplier=Verical; ComponentLink3URL: https://datasheet.ciiva.com/2454/pyu-r-int-thick-7-2454339.pdf?src-supplier=Digikey; ComponentLink3Description: https://datasheet.ciiva.com/2454/pyu-r-int-thick-7-2454339.pdf?src-supplier=Digikey; ComponentLink4URL: https://datasheet.ciiva.com/2454/pyu-r-int-thick-7-2454340.pdf?src-supplier=Digikey; ComponentLink4Description: https://datasheet.ciiva.com/2454/pyu-r-int-thick-7-2454340.pdf?src-supplier=Digikey; ComponentLink5URL: https://datasheet.ciiva.com/2454/pyu-r-int-thick-7-2454341.pdf?src-supplier=Digikey; ComponentLink5Description: https://datasheet.ciiva.com/2454/pyu-r-int-thick-7-2454341.pdf?src-supplier=Digikey; Supplier 1: Digikey; Supplier Part Number 1: 311-750KHRCT-ND
R6 = 680R_0603_Resistor: Fixed Resistor, Metal Glaze/thick Film, 0.1W, 680ohm, 75V, 1% +/-Tol, 100ppm/Cel, Surface Mount, 0603, ERJ-3EKF6800V Panasonic; Power: 100mW; Rated Temperature: 70°C; Value: 680R; Temperature Coefficient: 100ppm/°C; Package Height: 0.45mm; Package Length: 1.6mm; Package Width: 0.8mm; Reference Standard: AEC-Q200; Supplier: Digikey; Supplier Part Number: P680HCT-ND; Manufacturer: Panasonic; Manufacturer Part Number: ERJ-3EKF6800V; RoHS: Yes; Category: Chip SMD Resistors; Stock: 186007; Pricing: 1=0.1, 10=0.03, 50=0.0194, 100=0.0163, 500=0.01132, 1000=0.0098 (USD); Mounting Technology: Surface Mount; Pins: 2; Package Shape: Rectangular; Case/Package: 0603; Terminal Finish: Nickel; Min Operating Temperature: -55°C; Max Operating Temperature: 155°C; Tolerance: 1%; JESD-609 Code: e3; Resistor Type: FIXED RESISTOR; Construction: Rectangular; Package Style: SMTMeter; Packaging: Tape and Reel; Technology: METAL GLAZE/THICK FILM; Termination: Wraparound; Working Voltage: 75V; Reach SVHC Compliant: Yes; RoHS Compliant: Yes; ComponentLink1URL: https://datasheet.ciiva.com:443/pdfs/VipMasterIC/IC/PANA/PANA-S-A0009889626/PANA-S-A0009889626-1.pdf?src-supplier=IHS+Markit; ComponentLink1Description: https://datasheet.ciiva.com:443/pdfs/VipMasterIC/IC/PANA/PANA-S-A0009889626/PANA-S-A0009889626-1.pdf?src-supplier=IHS+Markit; ComponentLink2URL: https://datasheet.ciiva.com/5860/aoa0000ce2-5860666.pdf?src-supplier=Farnell; ComponentLink2Description: https://datasheet.ciiva.com/5860/aoa0000ce2-5860666.pdf?src-supplier=Farnell; ComponentLink3URL: https://datasheet.ciiva.com/9180/aoa0000ce2-9180426.pdf?src-supplier=Avnet; ComponentLink3Description: https://datasheet.ciiva.com/9180/aoa0000ce2-9180426.pdf?src-supplier=Avnet; ComponentLink4URL: https://datasheet.ciiva.com/9117/aoa0000ce2-9117115.pdf?src-supplier=Avnet; ComponentLink4Description: https://datasheet.ciiva.com/9117/aoa0000ce2-9117115.pdf?src-supplier=Avnet; ComponentLink5URL: https://datasheet.ciiva.com/24027/aoa0000ce2-24027373.pdf?src-supplier=Mouser; ComponentLink5Description: https://datasheet.ciiva.com/24027/aoa0000ce2-24027373.pdf?src-supplier=Mouser; ComponentLink6URL: https://datasheet.ciiva.com/16769/70260748-16769276.pdf?src-supplier=Allied+Electronics; ComponentLink6Description: https://datasheet.ciiva.com/16769/70260748-16769276.pdf?src-supplier=Allied+Electronics; ComponentLink7URL: https://datasheet.ciiva.com/22684/1678782-22684792.pdf?src-supplier=Element14; ComponentLink7Description: https://datasheet.ciiva.com/22684/1678782-22684792.pdf?src-supplier=Element14; ComponentLink8URL: https://datasheet.ciiva.com/46373/1678782-46373895.pdf?src-supplier=Element14; ComponentLink8Description: https://datasheet.ciiva.com/46373/1678782-46373895.pdf?src-supplier=Element14; ComponentLink9URL: https://datasheet.ciiva.com/46373/1678782-46373896.pdf?src-supplier=Element14; ComponentLink9Description: https://datasheet.ciiva.com/46373/1678782-46373896.pdf?src-supplier=Element14; ComponentLink10URL: https://datasheet.ciiva.com/30121/aoa0000ce2-30121175.pdf?src-supplier=Onlinecomponents.com; ComponentLink10Description: https://datasheet.ciiva.com/30121/aoa0000ce2-30121175.pdf?src-supplier=Onlinecomponents.com; ComponentLink11URL: https://datasheet.ciiva.com/22706/1678782-22706927.pdf?src-supplier=Element14; ComponentLink11Description: https://datasheet.ciiva.com/22706/1678782-22706927.pdf?src-supplier=Element14; ComponentLink12URL: https://datasheet.ciiva.com/7944/aoa0000ce2-7944621.pdf?src-supplier=Element14; ComponentLink12Description: https://datasheet.ciiva.com/7944/aoa0000ce2-7944621.pdf?src-supplier=Element14; Supplier 1: Digikey; Supplier Part Number 1: P680HCT-ND
R7 = 220R_0603_Resistor: Fixed Resistor, Metal Glaze/thick Film, 0.1W, 220ohm, 75V, 1% +/-Tol, 100ppm/Cel, Surface Mount, 0603, ERJ-3EKF2200V; Manufacturer: Panasonic; Power: 100mW; Rated Temperature: 70°C; Value: 220R; Temperature Coefficient: 100ppm/°C; Package Height: 0.45mm; Package Length: 1.6mm; Package Width: 0.8mm; Reference Standard: AEC-Q200; Supplier: Digikey; Supplier Part Number: P220HCT-ND; Manufacturer Part Number: ERJ-3EKF2200V; RoHS: Yes; Category: Chip SMD Resistors; Stock: 244259; Pricing: 1=0.1, 10=0.03, 50=0.0194, 100=0.0163, 500=0.01132, 1000=0.0098 (USD); Mounting Technology: Surface Mount; Pins: 2; Package Shape: Rectangular; Case/Package: 0603; Terminal Finish: Nickel; Min Operating Temperature: -55°C; Max Operating Temperature: 155°C; Tolerance: 1%; JESD-609 Code: e3; Resistor Type: FIXED RESISTOR; Construction: Rectangular; Package Style: SMTMeter; Packaging: Tape and Reel; Technology: METAL GLAZE/THICK FILM; Termination: Wraparound; Working Voltage: 75V; Reach SVHC Compliant: Yes; RoHS Compliant: Yes; ComponentLink1URL: https://datasheet.ciiva.com:443/pdfs/VipMasterIC/IC/PANA/PANA-S-A0009889626/PANA-S-A0009889626-1.pdf?src-supplier=IHS+Markit; ComponentLink1Description: https://datasheet.ciiva.com:443/pdfs/VipMasterIC/IC/PANA/PANA-S-A0009889626/PANA-S-A0009889626-1.pdf?src-supplier=IHS+Markit; ComponentLink2URL: https://datasheet.ciiva.com/6138/aoa0000ce2-6138702.pdf?src-supplier=Farnell; ComponentLink2Description: https://datasheet.ciiva.com/6138/aoa0000ce2-6138702.pdf?src-supplier=Farnell; ComponentLink3URL: https://datasheet.ciiva.com/9184/aoa0000ce2-9184299.pdf?src-supplier=Avnet; ComponentLink3Description: https://datasheet.ciiva.com/9184/aoa0000ce2-9184299.pdf?src-supplier=Avnet; ComponentLink4URL: https://datasheet.ciiva.com/24161/aoa0000ce2-24161898.pdf?src-supplier=Mouser; ComponentLink4Description: https://datasheet.ciiva.com/24161/aoa0000ce2-24161898.pdf?src-supplier=Mouser; ComponentLink5URL: https://datasheet.ciiva.com/28568/1678782-28568854.pdf?src-supplier=Element14; ComponentLink5Description: https://datasheet.ciiva.com/28568/1678782-28568854.pdf?src-supplier=Element14; ComponentLink6URL: https://datasheet.ciiva.com/46372/1678782-46372844.pdf?src-supplier=Element14; ComponentLink6Description: https://datasheet.ciiva.com/46372/1678782-46372844.pdf?src-supplier=Element14; ComponentLink7URL: https://datasheet.ciiva.com/46372/1678782-46372845.pdf?src-supplier=Element14; ComponentLink7Description: https://datasheet.ciiva.com/46372/1678782-46372845.pdf?src-supplier=Element14; ComponentLink8URL: https://datasheet.ciiva.com/7886/aoa0000ce2-7886727.pdf?src-supplier=Element14; ComponentLink8Description: https://datasheet.ciiva.com/7886/aoa0000ce2-7886727.pdf?src-supplier=Element14; ComponentLink9URL: https://datasheet.ciiva.com/16773/70260748-16773054.pdf?src-supplier=Allied+Electronics; ComponentLink9Description: https://datasheet.ciiva.com/16773/70260748-16773054.pdf?src-supplier=Allied+Electronics; ComponentLink10URL: https://datasheet.ciiva.com/16784/70260748-16784374.pdf?src-supplier=Allied+Electronics; ComponentLink10Description: https://datasheet.ciiva.com/16784/70260748-16784374.pdf?src-supplier=Allied+Electronics; Supplier 1: Digikey; Supplier Part Number 1: P220HCT-ND